# EAGLE schematic schema (EAGLE 7.2.0)
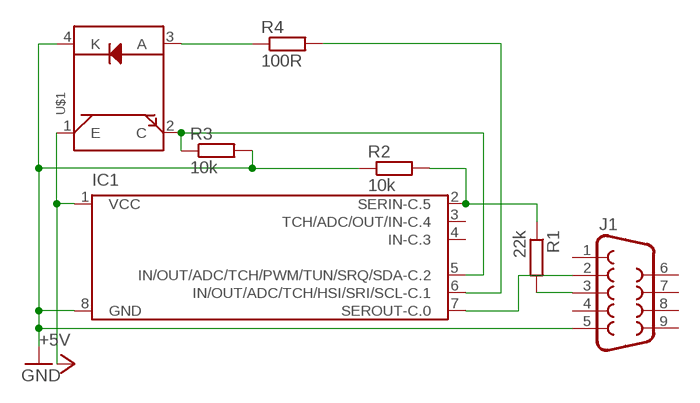
[diagram p0: schematic, sheet 1]

## Parts
IC1  PICAXE-08M2-DIL  [DIL8]
J1  DB9FEMALE  [DB9]
R1  22k  R0207/10  [0207/10]
R2  10k  R0207/10  [0207/10]
R3  10k  R0207/10  [0207/10]
R4  100R  R0207/10  [0207/10]
U$1  QRD1114  [QRD1114]

## Nets
+5V: IC1.1(VCC) U$1.1(E)
GND: IC1.8(GND) J1.5 R2.1 R3.2 U$1.4(K)
N$1: IC1.7(SEROUT-C.0) J1.2
N$2: J1.3 R1.2
N$4: R4.1 U$1.3(A)
N$5: IC1.6(IN/OUT/ADC/TCH/HSI/SRI/SCL-C.1) R4.2
N$6: IC1.5(IN/OUT/ADC/TCH/PWM/TUN/SRQ/SDA-C.2) R3.1 U$1.2(C)
N$10: IC1.2(SERIN-C.5) R1.1 R2.2
Unconnected: IC1.3(TCH/ADC/OUT/IN-C.4) IC1.4(IN-C.3) J1.1 J1.4 J1.6 J1.7 J1.8 J1.9

## Library data of the parts
IC1 = RONJA:PICAXE-08M2: Mikrokontrolér PICAXE 08M2
J1 = SparkFun-Connectors:DB9; PROD_ID: CONN-08194
R1-R4 = RONJA:R: RESISTOR, European symbol; SPICEMODEL: NONE; SPICEPREFIX: R
U$1 = RONJA:QRD1114: Reflexní optočlen QRD1114